# EAGLE schematic prototypeboard (EAGLE 9.2.2)
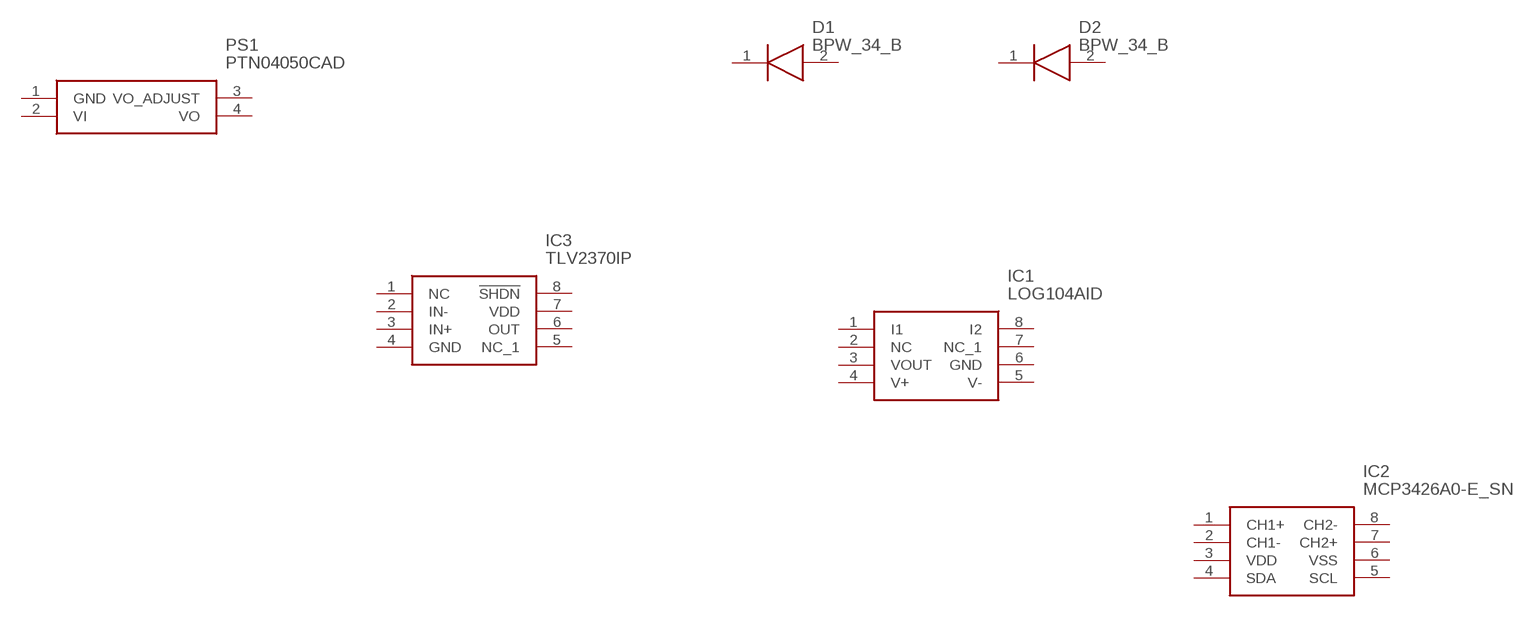
[diagram p0: schematic, sheet 1]

## Parts
D1  BPW_34_B  [BPW34B]
D2  BPW_34_B  [BPW34B]
IC1  LOG104AID  [SOIC127P600X175-8N]
IC2  MCP3426A0-E_SN  [SOIC127P600X175-8N]
IC3  TLV2370IP  [DIP794W53P254L959H508Q8N]
PS1  PTN04050CAD  [EUU(R-PDSS-T4)]
Unconnected: D1.1(K) D1.2(A) D2.1(K) D2.2(A) IC1.1(I1) IC1.2(NC) IC1.3(VOUT) IC1.4(V+) IC1.5(V-) IC1.7(NC_1) IC1.8(I2) IC2.1(CH1+) IC2.2(CH1-) IC2.4(SDA) IC2.5(SCL) IC2.7(CH2+) IC2.8(CH2-) IC3.1(NC) IC3.2(IN-) IC3.3(IN+) IC3.5(NC_1) IC3.6(OUT) IC3.8(!SHDN) PS1.1(GND) PS1.2(VI) PS1.3(VO_ADJUST) PS1.4(VO)

## Power pins joined to a net without a drawn wire
GND: IC1.6(GND) IC3.4(GND)
VDD: IC2.3(VDD) IC3.7(VDD)
VSS: IC2.6(VSS)

## Library data of the parts
D1 D2 = SamacSys_Parts:BPW_34_B: Photodiodes PHOTODIODE T/H Source: Datasheet <https://media.osram.info/media/resource/hires/osram-dam-2495824/BPW 34 B.pdf>; DESCRIPTION: Photodiodes PHOTODIODE T/H; HEIGHT: 2.2mm; MANUFACTURER_NAME: Osram Opto Semiconductor; MANUFACTURER_PART_NUMBER: BPW 34 B; MOUSER_PART_NUMBER: 720-BPW34B
IC1 = SamacSys_Parts:LOG104AID: LOG104AID, Logarithmic Amplifier, 8-Pin SOIC Source: Datasheet <http://www.ti.com/general/docs/suppproductinfo.tsp?distId=26&gotoUrl=http://www.ti.com/lit/gpn/log104>; DESCRIPTION: LOG104AID, Logarithmic Amplifier, 8-Pin SOIC; HEIGHT: 1.75mm; MANUFACTURER_NAME: Texas Instruments; MANUFACTURER_PART_NUMBER: LOG104AID; MOUSER_PART_NUMBER: 595-LOG104AID
IC2 = SamacSys_Parts:MCP3426A0-E_SN: 16-bit delta-sigma ADC, dual channel Source: Datasheet <https://componentsearchengine.com/Datasheets/1/MCP3426A0-E_SN.pdf>; DESCRIPTION: 16-bit delta-sigma ADC, dual channel; HEIGHT: 1.75mm; MANUFACTURER_NAME: Microchip; MANUFACTURER_PART_NUMBER: MCP3426A0-E/SN; MOUSER_PART_NUMBER: 579-MCP3426A0E/SN
IC3 = SamacSys_Parts:TLV2370IP: TLV2370IP, Operational Amplifier 3MHz Rail-Rail 3 to 15V, 8-Pin PDIP Source: Datasheet; DESCRIPTION: TLV2370IP, Operational Amplifier 3MHz Rail-Rail 3 to 15V, 8-Pin PDIP; HEIGHT: 5.08mm; MANUFACTURER_NAME: Texas Instruments; MANUFACTURER_PART_NUMBER: TLV2370IP; MOUSER_PART_NUMBER: 595-TLV2370IP
PS1 = SamacSys_Parts:PTN04050CAD: Texas Instruments PTN04050CAD, DC-DC Power Supply Module 2.4A 5.5 V Input, 600 kHz, 4-Pin, DIP Module Source: Datasheet <http://www.ti.com/lit/gpn/ptn04050c>; DESCRIPTION: Texas Instruments PTN04050CAD, DC-DC Power Supply Module 2.4A 5.5 V Input, 600 kHz, 4-Pin, DIP Module; HEIGHT: mm; MANUFACTURER_NAME: Texas Instruments; MANUFACTURER_PART_NUMBER: PTN04050CAD; MOUSER_PART_NUMBER: 595-PTN04050CAD